# Altium schematic sheet LC BigOne - 165 SerialIn Register (v2).SchDoc: DBL 165 Serial In Register
size A4; Organization: Controlled by GND; Revision: 0; SheetNumber: 1; SheetTotal: 1; Version: 2.0s; Variant: Controlled by GND; Modification: On IRF5850 Mosfet; Project: Light Control; PageSetup: Record=PageOptions|CenterHorizontal=True|CenterVertical=True|PrintScale=0.97|XCorrection=1.00|YCorrection=1.00|PrintKind=1|BorderSize=5000000|LeftOffset=0|BottomOffset=0|Orientation=2|PaperLength=2970|PaperWidth=2100|Scale=100|PaperSource=7|PrintQuality=-4|MediaType=1|DitherType=10|PaperKind=A4|PrintScaleMode=1; DocumentName: DBL 165 Serial In Register; ProjectName: LightControl
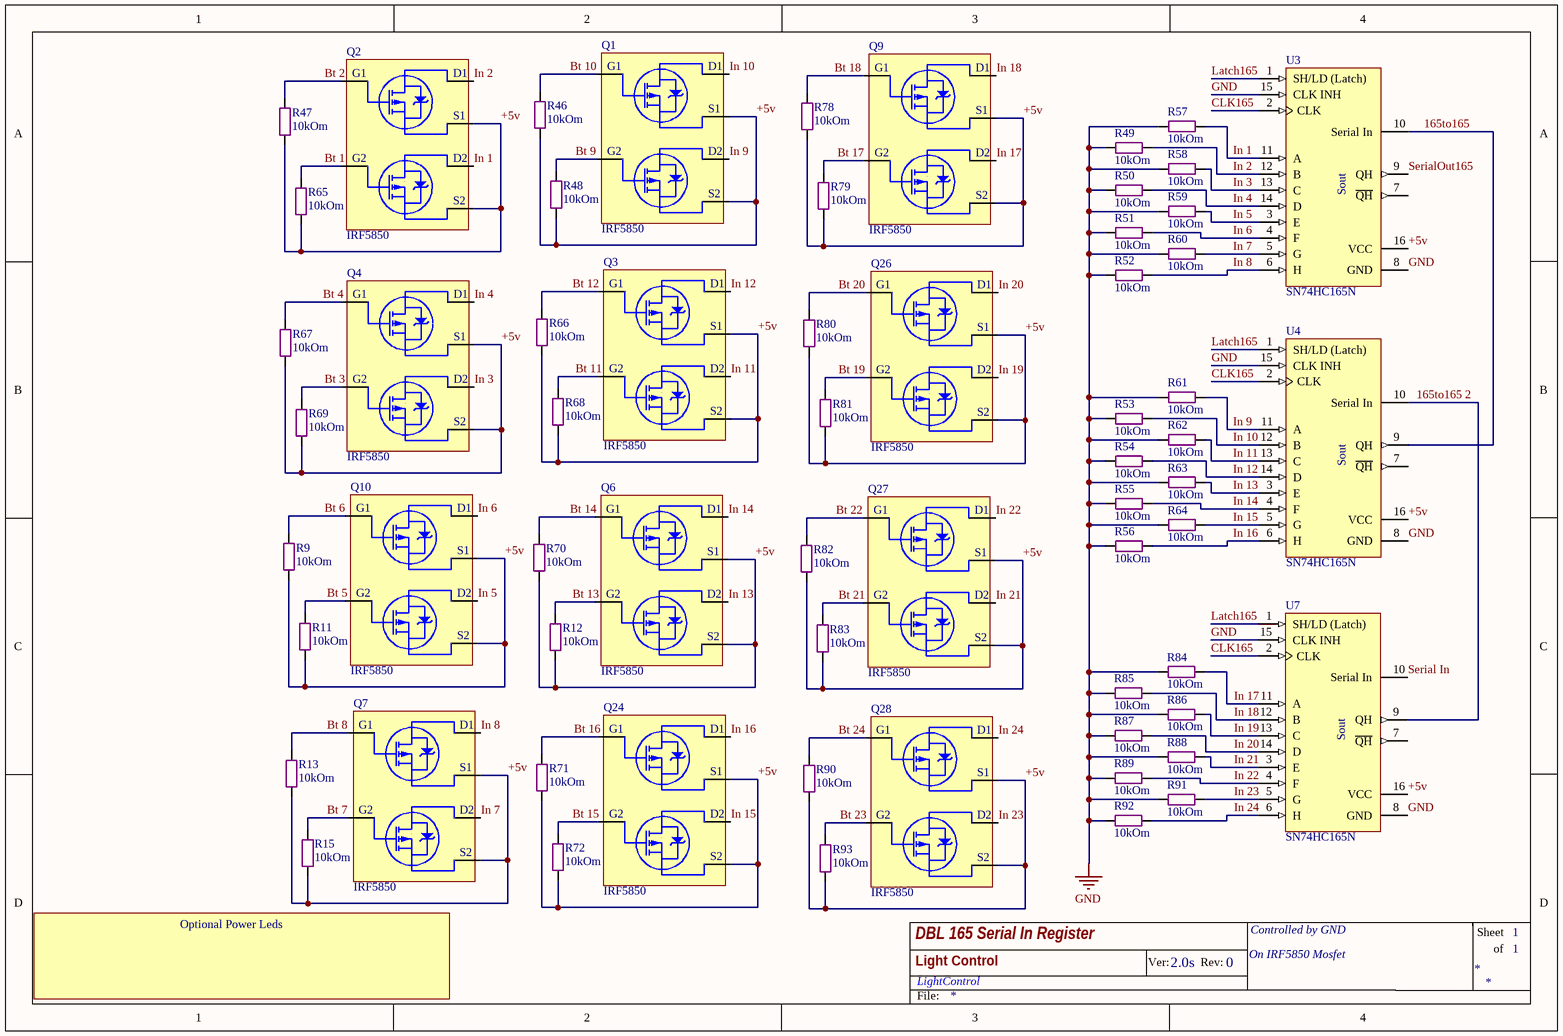
[diagram p0: LC BigOne - 165 SerialIn Register (v2).SchDoc]

## Parts
Q1  IRF5850  [TSOP-6]
Q2  IRF5850  [TSOP-6]
Q3  IRF5850  [TSOP-6]
Q4  IRF5850  [TSOP-6]
Q6  IRF5850  [TSOP-6]
Q7  IRF5850  [TSOP-6]
Q9  IRF5850  [TSOP-6]
Q10  IRF5850  [TSOP-6]
Q24  IRF5850  [TSOP-6]
Q26  IRF5850  [TSOP-6]
Q27  IRF5850  [TSOP-6]
Q28  IRF5850  [TSOP-6]
R9  10kOm  [SMD 0805 (2012)]
R11  10kOm  [SMD 0805 (2012)]
R12  10kOm  [SMD 0805 (2012)]
R13  10kOm  [SMD 0805 (2012)]
R15  10kOm  [SMD 0805 (2012)]
R46  10kOm  [SMD 0805 (2012)]
R47  10kOm  [SMD 0805 (2012)]
R48  10kOm  [SMD 0805 (2012)]
R49  10kOm  [SMD 0805 (2012)]
R50  10kOm  [SMD 0805 (2012)]
R51  10kOm  [SMD 0805 (2012)]
R52  10kOm  [SMD 0805 (2012)]
R53  10kOm  [SMD 0805 (2012)]
R54  10kOm  [SMD 0805 (2012)]
R55  10kOm  [SMD 0805 (2012)]
R56  10kOm  [SMD 0805 (2012)]
R57  10kOm  [SMD 0805 (2012)]
R58  10kOm  [SMD 0805 (2012)]
R59  10kOm  [SMD 0805 (2012)]
R60  10kOm  [SMD 0805 (2012)]
R61  10kOm  [SMD 0805 (2012)]
R62  10kOm  [SMD 0805 (2012)]
R63  10kOm  [SMD 0805 (2012)]
R64  10kOm  [SMD 0805 (2012)]
R65  10kOm  [SMD 0805 (2012)]
R66  10kOm  [SMD 0805 (2012)]
R67  10kOm  [SMD 0805 (2012)]
R68  10kOm  [SMD 0805 (2012)]
R69  10kOm  [SMD 0805 (2012)]
R70  10kOm  [SMD 0805 (2012)]
R71  10kOm  [SMD 0805 (2012)]
R72  10kOm  [SMD 0805 (2012)]
R78  10kOm  [SMD 0805 (2012)]
R79  10kOm  [SMD 0805 (2012)]
R80  10kOm  [SMD 0805 (2012)]
R81  10kOm  [SMD 0805 (2012)]
R82  10kOm  [SMD 0805 (2012)]
R83  10kOm  [SMD 0805 (2012)]
R84  10kOm  [SMD 0805 (2012)]
R85  10kOm  [SMD 0805 (2012)]
R86  10kOm  [SMD 0805 (2012)]
R87  10kOm  [SMD 0805 (2012)]
R88  10kOm  [SMD 0805 (2012)]
R89  10kOm  [SMD 0805 (2012)]
R90  10kOm  [SMD 0805 (2012)]
R91  10kOm  [SMD 0805 (2012)]
R92  10kOm  [SMD 0805 (2012)]
R93  10kOm  [SMD 0805 (2012)]
U3  SN74HC165N  [DIP-16]
U4  SN74HC165N  [DIP-16]
U7  SN74HC165N  [DIP-16]

## Nets
GND: R49.1 R50.1 R51.1 R52.1 R53.1 R54.1 R55.1 R56.1 R57.1 R58.1 R59.1 R60.1 R61.1 R62.1 R63.1 R64.1 R84.1 R85.1 R86.1 R87.1 R88.1 R89.1 R91.1 R92.1 U3.8(GND) U3.15(CLK_INH) U4.8(GND) U4.15(CLK_INH) U7.8(GND) U7.15(CLK_INH)
165to165: U3.10(Serial_In) U4.9(QH)
165to165 2: U4.10(Serial_In) U7.9(QH)
+5v: Q1.2(S2) Q1.5(S1) Q2.2(S2) Q2.5(S1) Q3.2(S2) Q3.5(S1) Q4.2(S2) Q4.5(S1) Q6.2(S2) Q6.5(S1) Q7.2(S2) Q7.5(S1) Q9.2(S2) Q9.5(S1) Q10.2(S2) Q10.5(S1) Q24.2(S2) Q24.5(S1) Q26.2(S2) Q26.5(S1) Q27.2(S2) Q27.5(S1) Q28.2(S2) Q28.5(S1) R9.2 R11.2 R12.2 R13.2 R15.2 R46.2 R47.2 R48.2 R65.2 R66.2 R67.2 R68.2 R69.2 R70.2 R71.2 R72.2 R78.2 R79.2 R80.2 R81.2 R82.2 R83.2 R90.2 R93.2 U3.16(VCC) U4.16(VCC) U7.16(VCC)
Bt 1: Q2.3(G2) R65.1
Bt 2: Q2.1(G1) R47.1
Bt 3: Q4.3(G2) R69.1
Bt 4: Q4.1(G1) R67.1
Bt 5: Q10.3(G2) R11.1
Bt 6: Q10.1(G1) R9.1
Bt 7: Q7.3(G2) R15.1
Bt 8: Q7.1(G1) R13.1
Bt 9: Q1.3(G2) R48.1
Bt 10: Q1.1(G1) R46.1
Bt 11: Q3.3(G2) R68.1
Bt 12: Q3.1(G1) R66.1
Bt 13: Q6.3(G2) R12.1
Bt 14: Q6.1(G1) R70.1
Bt 15: Q24.3(G2) R72.1
Bt 16: Q24.1(G1) R71.1
Bt 17: Q9.3(G2) R79.1
Bt 18: Q9.1(G1) R78.1
Bt 19: Q26.3(G2) R81.1
Bt 20: Q26.1(G1) R80.1
Bt 21: Q27.3(G2) R83.1
Bt 22: Q27.1(G1) R82.1
Bt 23: Q28.3(G2) R93.1
Bt 24: Q28.1(G1) R90.1
CLK165: U3.2(CLK) U4.2(CLK) U7.2(CLK)
In 1: Q2.4(D2) R57.2 U3.11(A)
In 2: Q2.6(D1) R49.2 U3.12(B)
In 3: Q4.4(D2) R58.2 U3.13(C)
In 4: Q4.6(D1) R50.2 U3.14(D)
In 5: Q10.4(D2) R59.2 U3.3(E)
In 6: Q10.6(D1) R51.2 U3.4(F)
In 7: Q7.4(D2) R60.2 U3.5(G)
In 8: Q7.6(D1) R52.2 U3.6(H)
In 9: Q1.4(D2) R61.2 U4.11(A)
In 10: Q1.6(D1) R53.2 U4.12(B)
In 11: Q3.4(D2) R62.2 U4.13(C)
In 12: Q3.6(D1) R54.2 U4.14(D)
In 13: Q6.4(D2) R63.2 U4.3(E)
In 14: Q6.6(D1) R55.2 U4.4(F)
In 15: Q24.4(D2) R64.2 U4.5(G)
In 16: Q24.6(D1) R56.2 U4.6(H)
In 17: Q9.4(D2) R84.2 U7.11(A)
In 18: Q9.6(D1) R85.2 U7.12(B)
In 19: Q26.4(D2) R86.2 U7.13(C)
In 20: Q26.6(D1) R87.2 U7.14(D)
In 21: Q27.4(D2) R88.2 U7.3(E)
In 22: Q27.6(D1) R89.2 U7.4(F)
In 23: Q28.4(D2) R91.2 U7.5(G)
In 24: Q28.6(D1) R92.2 U7.6(H)
Latch165: U3.1(SH/LD_(Latch)) U4.1(SH/LD_(Latch)) U7.1(SH/LD_(Latch))
Serial In: U7.10(Serial_In)
SerialOut165: U3.9(QH)

Not connected (* = marked no-connect by the designer): U3 7(~{QH}); U4 7(~{QH}); U7 7(~{QH})

## Notes on the sheet
- Optional Power Leds
- Ver:
- Rev:
- Sheet
- of
- File:
- (in symbol SN74HC165N) Sout

## Library data of the parts
Q1-Q4 Q6 Q7 Q9 Q10 Q24 Q26-Q28 = IRF5850: Dual P-Ch  20V - 0.135Ω - 2.2A; Monufacturer: IOR; V DSS (v): -20 V; RDS Сопротивление Сток-Исток: 0.135 Om; I d - Drain current (continuous) at TC = 70°C: 1.8 A; VGS Порог Открытия: -0.45...-1.2 V; VGS Макс напр на гейте: +-12 V; C ISS Входная емкость: 320 pF; C OSS Выходная емкость: 56 pF; I d - Drain current (continuous) at TC = 25°C: 2.2 A; Name: IRF5850; Datasheet: http://tec.org.ru/_bd/4/490_IRF5850.pdf; URL: http://tec.org.ru/board/irf5850/49-1-0-490
R9 R11-R13 R15 R46-R72 R78-R93 = Res All Types
U3 U4 U7 = SN74HC165N: 8-Bit Parallel-Load Shift Register; Published: 8-Jun-2000; LatestRevisionDate: 04-Mar-2005; LatestRevisionNote: Stylized 3D Model Added.; DatasheetVersion: May-1997; PackageVersion: Oct-1995; PackageReference: N016; Publisher: Altium Limited; PackageDescription: DIP; 16 Leads; Row Spacing 7.62 mm; Pitch 2.54 mm; Code_JEDEC: MS-001-BB; ComponentLink1Description: Manufacturer Link; ComponentLink1URL: http://www.ti.com/; ComponentLink2Description: Datasheet; ComponentLink2URL: http://www-s.ti.com/sc/ds/sn74hc165.pdf